# Altium schematic sheet Revision History.SchDoc
size A; Date: 06-March-2015; DrawnBy: Eng. Jorge Marin; DocumentNumber: 16; Revision: 1.0; SheetNumber: 16; SheetTotal: 16; ImagePath: C:\Users\Jorge\Desktop\Bynde Technologies\Logo.jpg; ProjectName: Bynde Device 1; Rule: PcbType=ProtelPcb
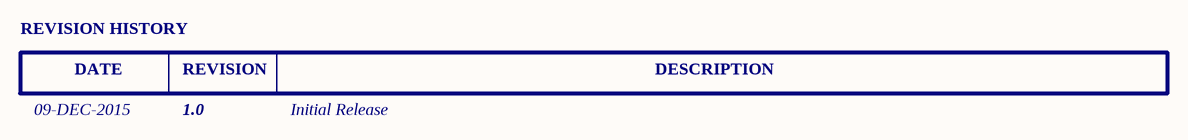
[diagram p0: Revision History.SchDoc]

## Notes on the sheet
- REVISION HISTORY
- 09-DEC-2015
- DATE
- 1.0
- REVISION
- Initial Release
- DESCRIPTION
- Sheet Title:
- ProjectTitle:
- Size:
- Date:
- Company:
- A
- Number:
- Rev:
- Sheet         of
- Drawn by: